# Altium schematic sheet I2C.SchDoc
size 420 x 297 mm; SheetNumber: 2; SheetTotal: 2
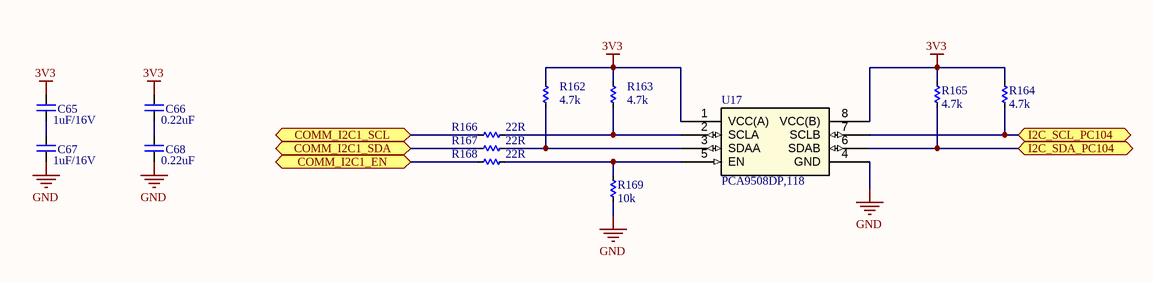
[diagram p0: I2C.SchDoc]

## Parts
C65  1uF/16V  [CAP_C_1608X80]
C66  0.22uF  [CAP_C_1608X80]
C67  1uF/16V  [CAP_C_1608X80]
C68  0.22uF  [CAP_C_1608X80]
R162  4.7k  [RES_C_1608X60]
R163  4.7k  [RES_C_1608X60]
R164  4.7k  [RES_C_1608X60]
R165  4.7k  [RES_C_1608X60]
R166  22R  [RES_C_1608X60]
R167  22R  [RES_C_1608X60]
R168  22R  [RES_C_1608X60]
R169  10k  [RES_C_1608X60]
U17  PCA9508DP,118  [TSSOP8_SOT505-1_NXP]

## Ports
COMM_I2C1_EN (bidir), COMM_I2C1_SCL (bidir), COMM_I2C1_SDA (bidir), I2C_SCL_PC104 (bidir), I2C_SDA_PC104 (bidir)

## Nets
3V3: C65.2 C66.2 R162.1 R163.1 R164.1 R165.1 U17.1(VCC(A)) U17.8(VCC(B))
GND: C67.1 C68.1 R169.2 U17.4(GND)
COMM_I2C1_EN: R168.2 ; port COMM_I2C1_EN
COMM_I2C1_SCL: R166.2 ; port COMM_I2C1_SCL
COMM_I2C1_SDA: R167.2 ; port COMM_I2C1_SDA
I2C_SCL_PC104: R164.2 U17.7(SCLB) ; port I2C_SCL_PC104
I2C_SDA_PC104: R165.2 U17.6(SDAB) ; port I2C_SDA_PC104
NetC65_1: C65.1 C67.2
NetC66_1: C66.1 C68.2
NetR162_2: R162.2 R167.1 U17.3(SDAA)
NetR163_2: R163.2 R166.1 U17.2(SCLA)
NetR168_1: R168.1 R169.1 U17.5(EN)

## Notes on the sheet
- Sub-system:
- Design by:
- Sheet title:
- Project:
- Sheet:
- of
- Checked by:
- Approved by:
- Doc no:
- Revision:
- Size:
- Date:

## Library data of the parts
C65-C68 = CAP_SMD: CAP_Chip; Value: 33pF
R162-R169 = _RES_B_2: RES
U17 = PCA9508DP,118: No Description Available; Manufacturer_Name: NXP; Copyright: Copyright (C) 2025 Ultra Librarian. All rights reserved.; Manufacturer_Part_Number: PCA9508DP,118; RefDes: RefDes; Type: Type